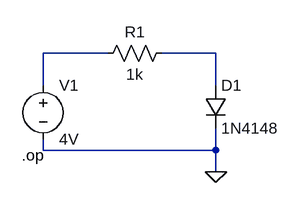
[diagram p0: schematic 1.asc]
1.asc, the LTspice schematic file:
Version 4
SHEET 1 880 680
WIRE 144 64 48 64
WIRE 304 64 224 64
WIRE 48 112 48 64
WIRE 304 112 304 64
WIRE 48 208 48 192
WIRE 304 208 304 176
WIRE 304 208 48 208
WIRE 304 240 304 208
FLAG 304 240 0
SYMBOL diode 288 112 R0
SYMATTR InstName D1
SYMATTR Value 1N4148
SYMBOL res 240 48 R90
WINDOW 0 0 56 VBottom 2
WINDOW 3 32 56 VTop 2
SYMATTR InstName R1
SYMATTR Value 1k
SYMBOL voltage 48 96 R0
SYMATTR InstName V1
SYMATTR Value 4V
TEXT 16 216 Left 2 !.op

The netlist it stands for:
* 1.asc
D1 N002 0 1N4148
R1 N002 N001 1k
V1 N001 0 4V
.model D D
.lib standard.dio
.op
.backanno
.end